# EasyEDA schematic SCH_DrumSet_2024-08-07.json
TITLE: Sheet_1; REV: 1.0; Date: 2024-04-22; Sheet: 1/1; Drawn By: jamatop; Company: Your Company
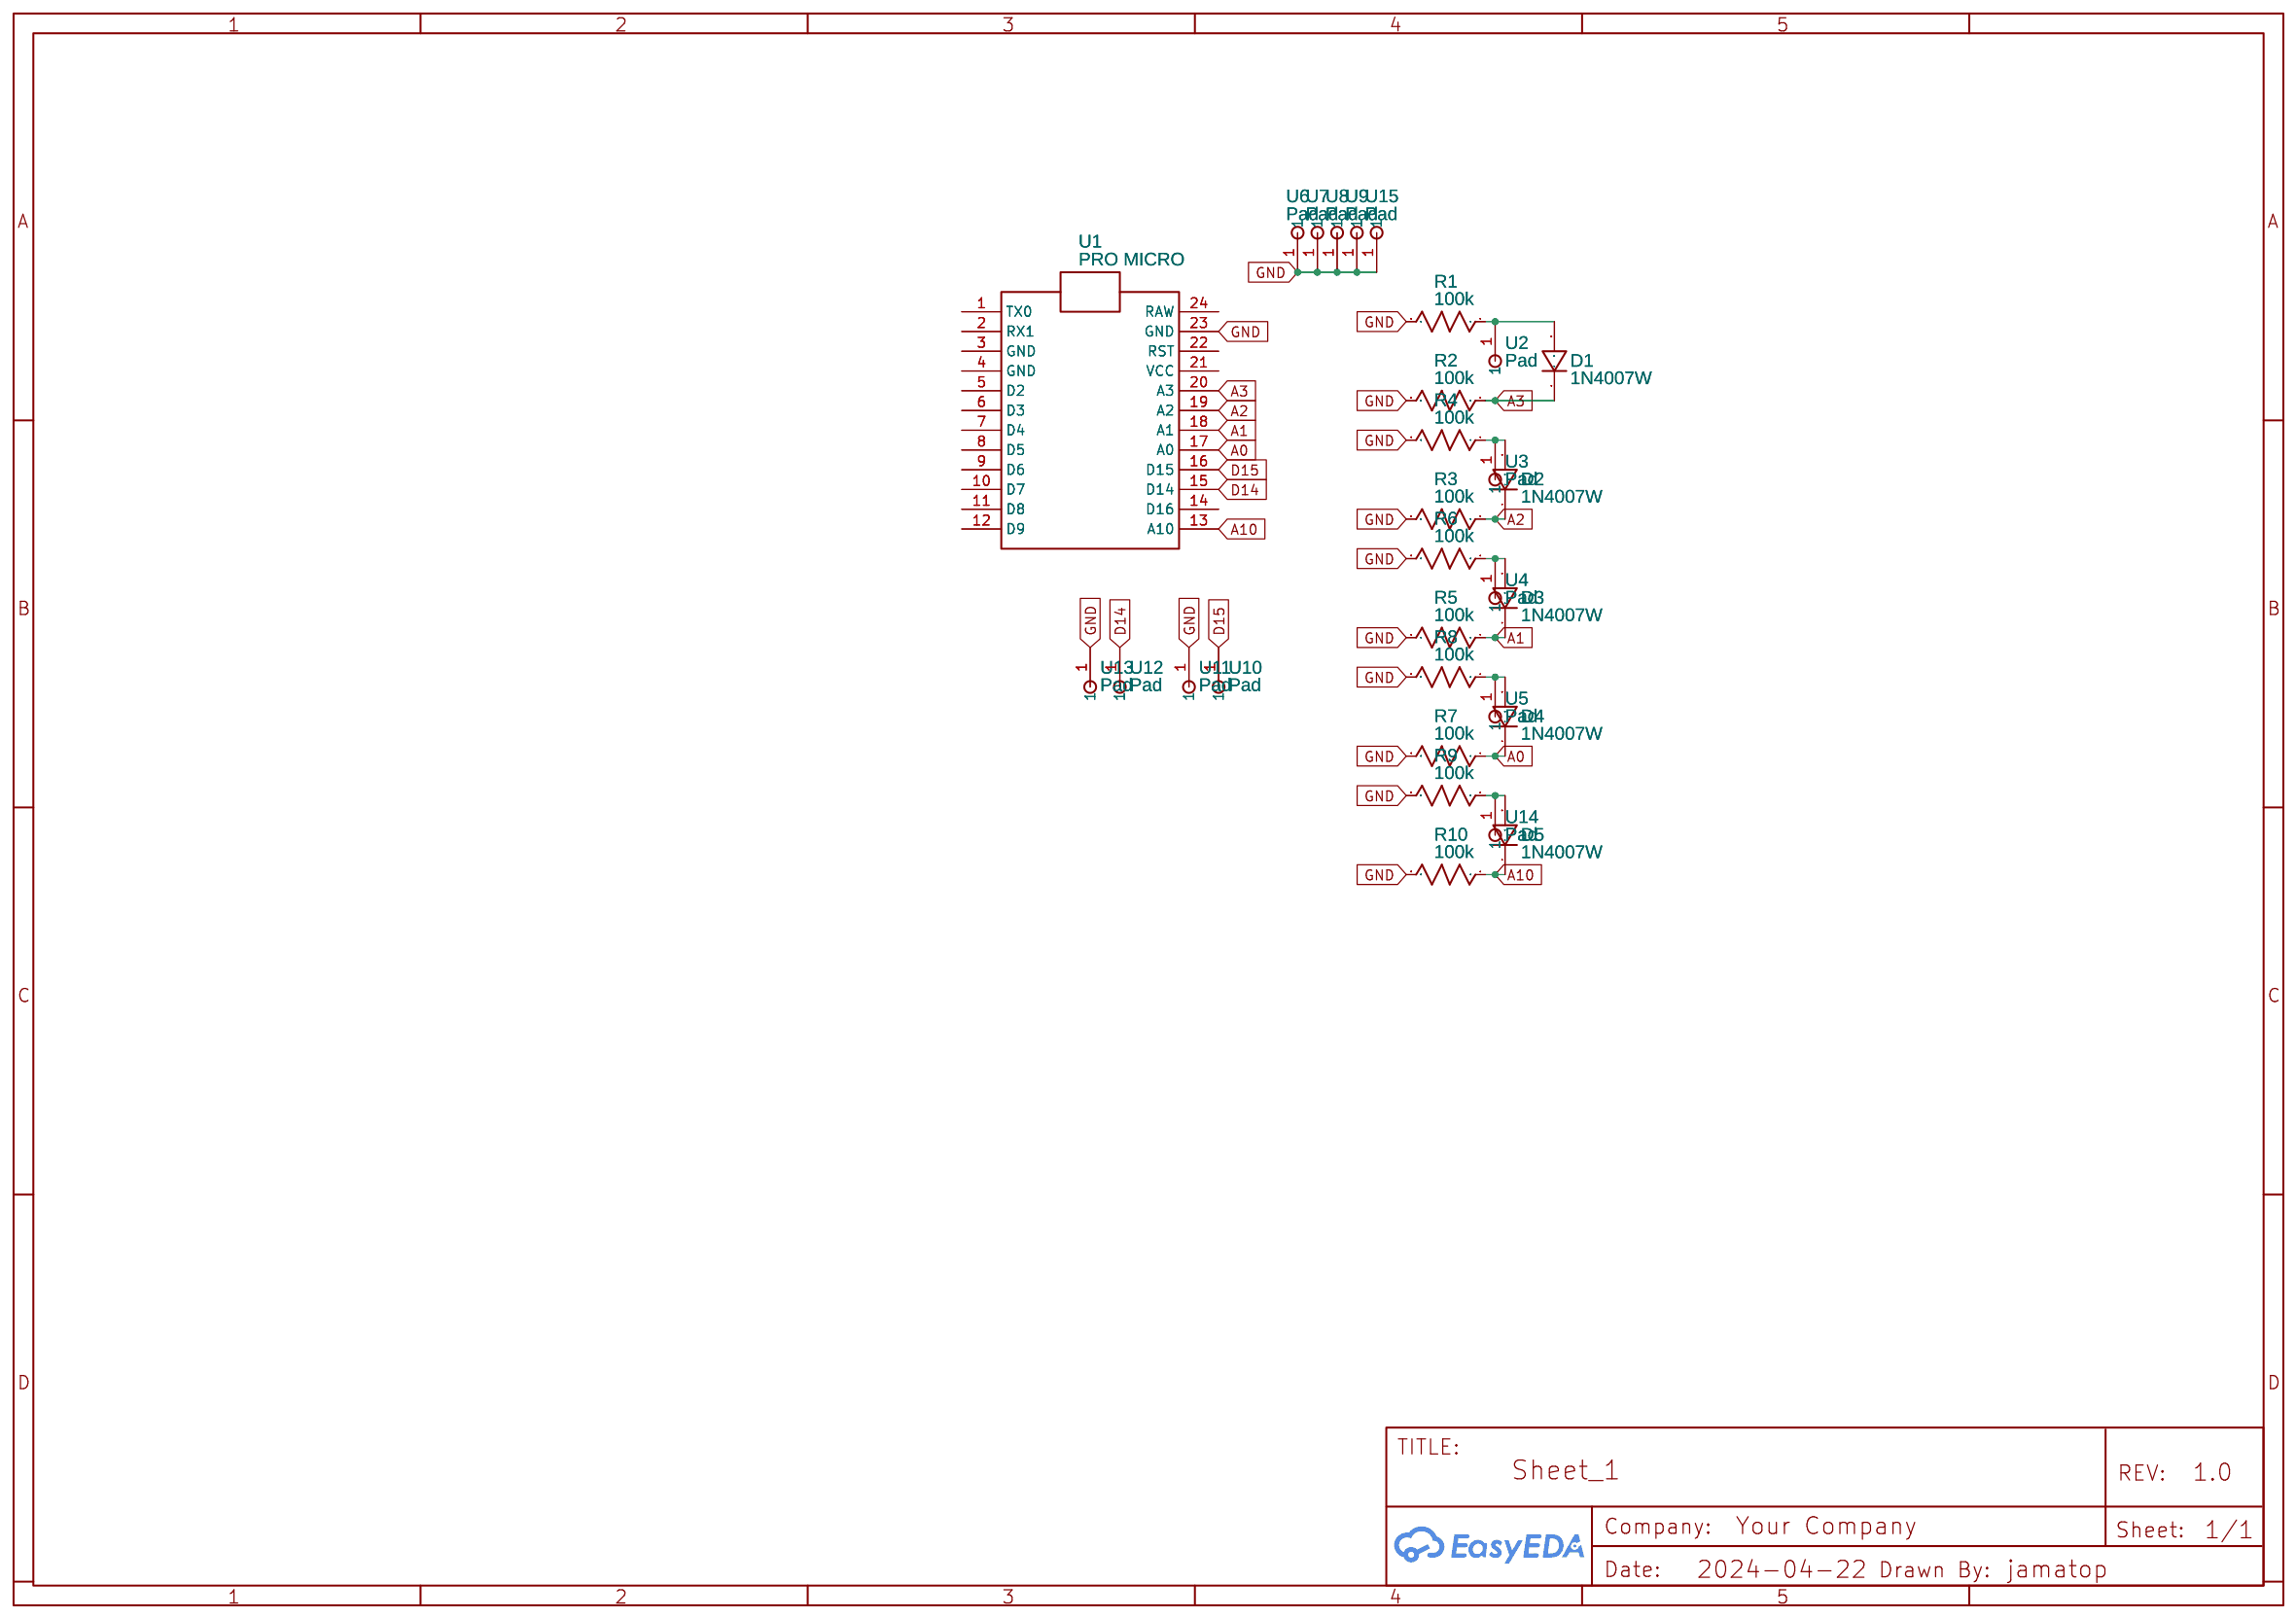
[diagram p0: schematic sheet]

## Parts
D1  1N4007W  [SOD-123_L2.8-W1.8-LS3.7-RD]
D2  1N4007W  [SOD-123_L2.8-W1.8-LS3.7-RD]
D3  1N4007W  [SOD-123_L2.8-W1.8-LS3.7-RD]
D4  1N4007W  [SOD-123_L2.8-W1.8-LS3.7-RD]
D5  1N4007W  [SOD-123_L2.8-W1.8-LS3.7-RD]
R1  100k  [R0603]
R2  100k  [R0603]
R3  100k  [R0603]
R4  100k  [R0603]
R5  100k  [R0603]
R6  100k  [R0603]
R7  100k  [R0603]
R8  100k  [R0603]
R9  100k  [R0603]
R10  100k  [R0603]
U1  PRO MICRO  [ARDUINO-PRO-MICRO]
U2  Pad  [SOLDERINGPAD]
U3  Pad  [SOLDERINGPAD]
U4  Pad  [SOLDERINGPAD]
U5  Pad  [SOLDERINGPAD]
U6  Pad  [SOLDERINGPAD]
U7  Pad  [SOLDERINGPAD]
U8  Pad  [SOLDERINGPAD]
U9  Pad  [SOLDERINGPAD]
U10  Pad  [SOLDERINGPAD]
U11  Pad  [SOLDERINGPAD]
U12  Pad  [SOLDERINGPAD]
U13  Pad  [SOLDERINGPAD]
U14  Pad  [SOLDERINGPAD]
U15  Pad  [SOLDERINGPAD]

## Library data of the parts
D1-D5 = 1N4007W: Supplier: LCSC; Supplier Part: C328592; Manufacturer: BLUE ROCKET; Contributor: LCEDA_Lib
R1-R10 = R_0603_US: Contributor: LCEDA_Lib
U1 = PRO MICRO: Contributor: Matheus rampazzo e silva
U2-U15 = Pad: Manufacturer Part: AdamsPads; Contributor: janchristoph

## Nets
GND: R1.2 R2.2 R3.2 R4.2 R5.2 R6.2 R7.2 R8.2 R9.2 R10.2 U1.23(GND) U6.1 U7.1 U8.1 U9.1 U11.1 U13.1 U15.1
A0: D4.1 R7.1 U1.17(A0)
A1: D3.1 R5.1 U1.18(A1)
A2: D2.1 R3.1 U1.19(A2)
A3: D1.1 R2.1 U1.20(A3)
A10: D5.1 R10.1 U1.13(A10)
D14: U1.15(D14) U12.1
D15: U1.16(D15) U10.1
Net-(D1-2): D1.2 R1.1 U2.1
Net-(D2-2): D2.2 R4.1 U3.1
Net-(D3-2): D3.2 R6.1 U4.1
Net-(D4-2): D4.2 R8.1 U5.1
Net-(D5-2): D5.2 R9.1 U14.1

Not connected (* = marked no-connect by the designer): U1 1(TX0) 2(RX1) 3(GND) 4(GND) 5(D2) 6(D3) 7(D4) 8(D5) 9(D6) 10(D7) 11(D8) 12(D9) 14(D16) 21(VCC) 22(RST) 24(RAW)
